# Altium schematic sheet PIC Microcontroller.SchDoc: AA Design Challenge
size 431 x 279 mm; Revision: 1.0; SheetNumber: 3; SheetTotal: 4; ProjectName: TRK_GPRS_GNSS_BTLE
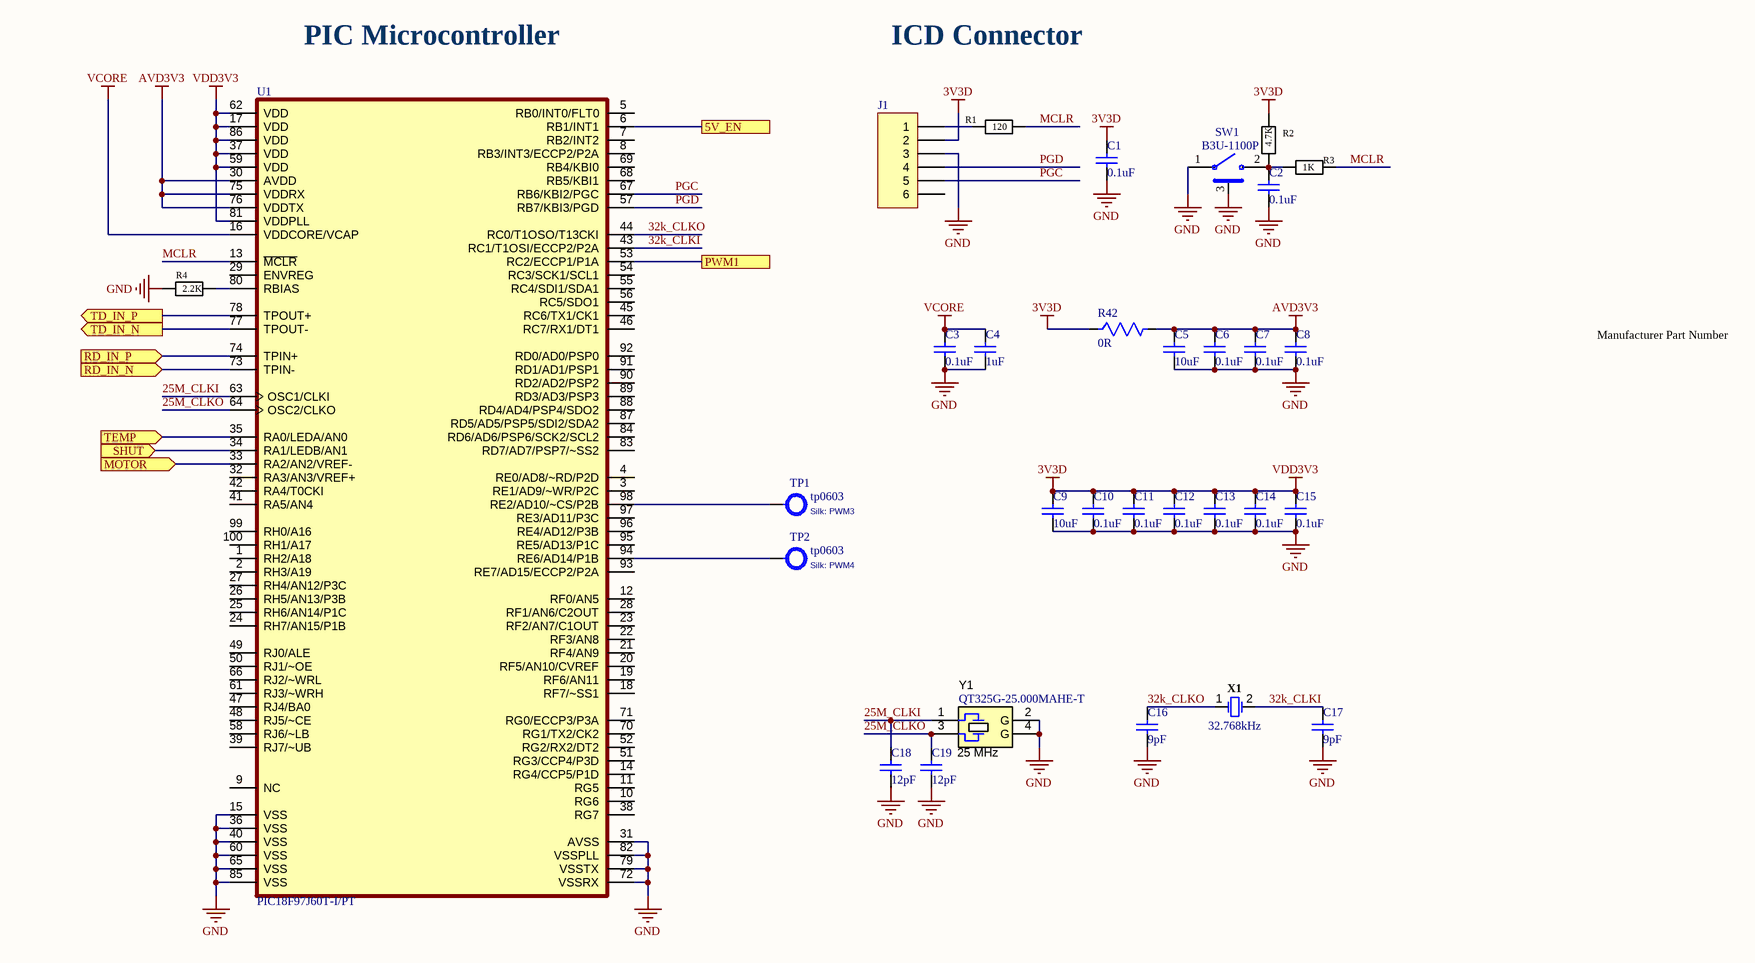
[diagram p0: PIC Microcontroller.SchDoc]

## Parts
C1  0.1uF  [CAPC1005X61USR]
C2  0.1uF  [CAPC1005X61USR]
C3  0.1uF  [CAPC1005X61USR]
C4  1uF  [CAPC1005X61USR]
C5  10uF  [CAPC1005X61USR]
C6  0.1uF  [CAPC1005X61USR]
C7  0.1uF  [CAPC1005X61USR]
C8  0.1uF  [CAPC1005X61USR]
C9  10uF  [CAPC1005X61USR]
C10  0.1uF  [CAPC1005X61USR]
C11  0.1uF  [CAPC1005X61USR]
C12  0.1uF  [CAPC1005X61USR]
C13  0.1uF  [CAPC1005X61USR]
C14  0.1uF  [CAPC1005X61USR]
C15  0.1uF  [CAPC1005X61USR]
C16  9pF  [CAPC1005X61USR]
C17  9pF  [CAPC1005X61USR]
C18  12pF  [CAPC1005X61USR]
C19  12pF  [CAPC1005X61USR]
J1  Header 6  [HDR1X6]  (value not drawn)  (no BOM)
R1  120  [RESC1005X40USR]
R2  4.7K  [RESC1005X40USR]
R3  1K  [RESC1005X40USR]
R4  2.2K  [RESC1005X40USR]
R42  0R  [R_0603]
SW1  B3U-1100P  [SW_B3U-1100P]
TP1  tp0603  Silk: PWM3  [TP 1mm]
TP2  tp0603  Silk: PWM4  [TP 1mm]
U1  PIC18F97J60T-I/PT  [QFP40P1400X1400X120-100N]
X1  32.768kHz  [XTAL_3215]
Y1  QT325G-25.000MAHE-T  Frequency_Fixed: 25 MHz  [XTAL_3225]

## Ports
5V_EN, MOTOR (in), PWM1, RD_IN_N (in), RD_IN_P (in), SHUT (in), TD_IN_N (out), TD_IN_P (out), TEMP (in)

## Nets
3V3D: C1.1 C9.1 C10.1 C11.1 C12.1 C13.1 C14.1 C15.1 J1.2 R2.1 R42.1 U1.17(VDD) U1.37(VDD) U1.59(VDD) U1.62(VDD) U1.81(VDDPLL) U1.86(VDD)  [also labelled VDD3V3]
AVD3V3: C5.1 C6.1 C7.1 C8.1 R42.2 U1.30(AVDD) U1.75(VDDRX) U1.76(VDDTX)
GND: C1.2 C2.2 C3.2 C4.1 C5.2 C6.2 C7.2 C8.2 C9.2 C10.2 C11.2 C12.2 C13.2 C14.2 C15.2 C16.2 C17.2 C18.2 C19.2 J1.3 R4.1 SW1.1 SW1.3 U1.15(VSS) U1.31(AVSS) U1.36(VSS) U1.40(VSS) U1.60(VSS) U1.65(VSS) U1.72(VSSRX) U1.79(VSSTX) U1.82(VSSPLL) U1.85(VSS) Y1.2(GND) Y1.4(GND)
VCORE: C3.1 C4.2 U1.16(VDDCORE/VCAP)
5V_EN: U1.6(RB1/INT1) ; port 5V_EN
25M_CLKI: C18.1 U1.63(OSC1/CLKI) Y1.1
25M_CLKO: C19.1 U1.64(OSC2/CLKO) Y1.3
32k_CLKI: C17.1 U1.43(RC1/T1OSI/ECCP2/P2A) X1.2
32k_CLKO: C16.1 U1.44(RC0/T1OSO/T13CKI) X1.1
MCLR: R1.2 R3.2 U1.13(~{MCLR})
MOTOR: U1.33(RA2/AN2/VREF-) ; port MOTOR
PGC: J1.5 U1.67(RB6/KBI2/PGC)
PGD: J1.4 U1.57(RB7/KBI3/PGD)
PWM1: U1.53(RC2/ECCP1/P1A) ; port PWM1
RD_IN_N: U1.73(TPIN-) ; port RD_IN_N
RD_IN_P: U1.74(TPIN+) ; port RD_IN_P
SHUT: U1.34(RA1/LEDB/AN1) ; port SHUT
TD_IN_N: U1.77(TPOUT-) ; port TD_IN_N
TD_IN_P: U1.78(TPOUT+) ; port TD_IN_P
TEMP: U1.35(RA0/LEDA/AN0) ; port TEMP
NetC2_1: C2.1 R2.2 R3.1 SW1.2
NetJ1_1: J1.1 R1.1
NetR4_2: R4.2 U1.80(RBIAS)
NetTP1_1: TP1.1 U1.98(RE2/AD10/~CS/P2B)
NetTP2_1: TP2.1 U1.94(RE6/AD14/P1B)

Not connected (* = marked no-connect by the designer): J1 6; U1 1(RH2/A18) 2(RH3/A19) 3(RE1/AD9/~WR/P2C) 4(RE0/AD8/~RD/P2D) 5(RB0/INT0/FLT0) 7(RB2/INT2) 8(RB3/INT3/ECCP2/P2A) 9(NC) 10(RG6) 11(RG5) 12(RF0/AN5) 14(RG4/CCP5/P1D) 18(RF7/~SS1) 19(RF6/AN11) 20(RF5/AN10/CVREF) 21(RF4/AN9) 22(RF3/AN8) 23(RF2/AN7/C1OUT) 24(RH7/AN15/P1B) 25(RH6/AN14/P1C) 26(RH5/AN13/P3B) 27(RH4/AN12/P3C) 28(RF1/AN6/C2OUT) 29(ENVREG) 32(RA3/AN3/VREF+) 38(RG7) 39(RJ7/~UB) 41(RA5/AN4) 42(RA4/T0CKI) 45(RC6/TX1/CK1) 46(RC7/RX1/DT1) 47(RJ4/BA0) 48(RJ5/~CE) 49(RJ0/ALE) 50(RJ1/~OE) 51(RG3/CCP4/P3D) 52(RG2/RX2/DT2) 54(RC3/SCK1/SCL1) 55(RC4/SDI1/SDA1) 56(RC5/SDO1) 58(RJ6/~LB) 61(RJ3/~WRH) 66(RJ2/~WRL) 68(RB5/KBI1) 69(RB4/KBI0) 70(RG1/TX2/CK2) 71(RG0/ECCP3/P3A) 83(RD7/AD7/PSP7/~SS2) 84(RD6/AD6/PSP6/SCK2/SCL2) 87(RD5/AD5/PSP5/SDI2/SDA2) 88(RD4/AD4/PSP4/SDO2) 89(RD3/AD3/PSP3) 90(RD2/AD2/PSP2) 91(RD1/AD1/PSP1) 92(RD0/AD0/PSP0) 93(RE7/AD15/ECCP2/P2A) 95(RE5/AD13/P1C) 96(RE4/AD12/P3B) 97(RE3/AD11/P3C) 99(RH0/A16) 100(RH1/A17)

## Notes on the sheet
- PIC Microcontroller
- ICD Connector
- Manufacturer Part Number
- DWG. NO.
- REV.
- SHT.
- THIS DOCUMENT AND THE DATA DISCLOSED HEREIN OR HEREWITH IS THE PROPERTY OF ALTIUM LIMITED AND MAY BE FREELY DISTRIBUTED IN WHOLE. NO RIGHTS ARE RESERVED OR EXPRESS OR IMPLIED WARANTEE GIVEN.
- REVISION
- DESCRIPTION
- DATE
- APPROVED
- ENG:
- APPROVALS
- PROJECT
- DSN:
- CHK:
- REFERENCE DOCUMENTS
- PROJECT REVISION:
- TITLE
- DOCUMENT REVISION:
- DESIGN ITEM:
- BOM:
- FAB DWG:
- PCB DWG:
- ASSY DWG:
- SCALE:
- SIZE
- B
- CAGE CODE
- FILE NAME
- DWG NO.
- SHEET
- OF
- REV
- (in symbol ABM8AIG-25.000MHZ-12-2Z-T3) G

## Library data of the parts
C1-C3 C6-C8 C10-C15 = Cap: CAP CER 0.1UF 50V X7R 0402; Manufacturer: TDK Corporation; Manufacturer Part Number: CGA2B3X7R1H104K050BB; Supplier Part Number 1: 445-6899-2-ND; Supplier Part Number 2: *; Supplier 1: *; Supplier 2: *; 100pc cost: *; 1pc cost: *; Height: *; value: 0.1uF
C4 = Cap: CAP CER 1UF 16V X5R 0402; Manufacturer: Samsung Electro-Mechanics; Manufacturer Part Number: CL05A105KO5NNNC; Supplier Part Number 1: 1276-1067-2-ND; Supplier Part Number 2: *; Supplier 1: *; Supplier 2: *; 100pc cost: *; 1pc cost: *; Height: *; value: 1uF
C5 C9 = Cap: CAP CER 10UF 10V X5R 0402; Manufacturer: Samsung Electro-Mechanics; Manufacturer Part Number: CL05A106MP8NUB8; Supplier Part Number 1: 1276-6830-2-ND; Supplier Part Number 2: *; Supplier 1: *; Supplier 2: *; 100pc cost: *; 1pc cost: *; Height: *; value: 10uF
C16 C17 = Cap: CAP CER 9PF 50V C0G/NPO 0402; Manufacturer: Yageo; Manufacturer Part Number: CC0402BRNPO9BN9R0; Supplier Part Number 1: 311-1629-2-ND; Supplier Part Number 2: *; Supplier 1: *; Supplier 2: *; 100pc cost: *; 1pc cost: *; Height: *; value: 9pF
C18 C19 = Cap: CAP CER 12PF 50V C0G 0402; Manufacturer: TDK Corporation; Manufacturer Part Number: CGA2B2C0G1H120J050BA; Supplier Part Number 1: 445-5585-2-ND; Supplier Part Number 2: *; Supplier 1: *; Supplier 2: *; 100pc cost: *; 1pc cost: *; Height: *; value: 12pF
J1 = Header 6: Header, 6-Pin; LatestRevisionDate: 17-Jul-2002; LatestRevisionNote: Re-released for DXP Platform.; Publisher: Altium Limited
R1 = R: RES SMD 120 OHM 1% 1/16W 0402; Manufacturer: Yageo; Manufacturer Part Number: RC0402FR-07120RL; Power Rating: 62.5mW; Tolerance: +/-1%; Voltage Rating: NA; Distributor: DigiKey; Value: 120; Distributor Art. Nbr.: 311-120LRTR-ND; Package: EIA-0402; Price Estim. @ 100pcs: 0.0049; Height: 0.40mm
R2 = R: RES SMD 4.7K OHM 1% 1/16W 0402; Manufacturer: Yageo; Manufacturer Part Number: RC0402FR-074K7L; Power Rating: 62.5mW; Tolerance: +/-1%; Voltage Rating: NA; Distributor: DigiKey; Value: 4.7K; Distributor Art. Nbr.: 311-4.7KLRTR-ND; Package: EIA-0402; Price Estim. @ 100pcs: 0.0049; Height: 0.40mm
R3 = R: RES SMD 1K OHM 1% 1/16W 0402; Manufacturer: Yageo; Manufacturer Part Number: RC0402FR-071KL; Power Rating: 62.5mW; Tolerance: +/-1%; Voltage Rating: NA; Distributor: DigiKey; Value: 1K; Distributor Art. Nbr.: 311-1.00KLRTR-ND; Package: EIA-0402; Price Estim. @ 100pcs: 0.0049; Height: 0.40mm
R4 = R: RES SMD 2.2K OHM 1% 1/16W 0402; Manufacturer: Yageo; Manufacturer Part Number: RC0402FR-072K2L; Power Rating: 62.5mW; Tolerance: +/-1%; Voltage Rating: NA; Distributor: DigiKey; Value: 2.2K; Distributor Art. Nbr.: 311-2.20KLRTR-ND; Package: EIA-0402; Price Estim. @ 100pcs: 0.0049; Height: 0.40mm
R42 = Res 0R 1/10W 0603: Fixed Resistor, Metal Glaze/thick Film, 0.1W, 0ohm, Surface Mount, 0603; Manufacturer: Yageo; Manufacturer Part Number: RC0603FR-070RL; Rated Power Dissipation (P): 100mW; Rated Temperature: 70°C; Supplier 1: Mouser; Supplier Part Number 1: 603-RC0603FR-070RL; RoHS: Yes; Category: Chip SMD Resistors; Stock 1: 4979913; Pricing 1: 1=0.10000, 10=0.01200, 50=0.01200, 100=0.00900, 1000=0.00500, 10000=0.00300 (USD); Mount: Surface Mount; Number of Pins: 2; Package Shape: Rectangular; Size Code: 0603; Terminal Finish: Nickel; Min Operating Temperature: -55°C; Max Operating Temperature: 155°C; JESD-609 Code: e3; Resistor Type: FIXED RESISTOR; Packaging: Tape and Reel; Resistance: 0R; Termination: Wraparound; Technology: METAL GLAZE/THICK FILM; REACH SVHC: Yes; RoHS Compliant: Yes; ComponentLink1URL: https://datasheet.ciiva.com:443/pdfs/VipMasterIC/IC/YAGO/YAGOS02869/YAGOS02869-1.pdf?src-supplier=IHS+Markit; ComponentLink1Description: https://datasheet.ciiva.com:443/pdfs/VipMasterIC/IC/YAGO/YAGOS02869/YAGOS02869-1.pdf?src-supplier=IHS+Markit; ComponentLink2URL: https://datasheet.ciiva.com/11808/0900766b80f96399-11808172.pdf?src-supplier=RSComponents; ComponentLink2Description: https://datasheet.ciiva.com/11808/0900766b80f96399-11808172.pdf?src-supplier=RSComponents; ComponentLink3URL: https://datasheet.ciiva.com/5684/443971-5684699.pdf?src-supplier=Farnell; ComponentLink3Description: https://datasheet.ciiva.com/5684/443971-5684699.pdf?src-supplier=Farnell; ComponentLink4URL: https://datasheet.ciiva.com/7983/443971-7983627.pdf?src-supplier=Element14; ComponentLink4Description: https://datasheet.ciiva.com/7983/443971-7983627.pdf?src-supplier=Element14; ComponentLink5URL: https://datasheet.ciiva.com/22643/1868787-22643388.pdf?src-supplier=Element14; ComponentLink5Description: https://datasheet.ciiva.com/22643/1868787-22643388.pdf?src-supplier=Element14; ComponentLink6URL: https://datasheet.ciiva.com/46382/443971-46382072.pdf?src-supplier=Element14; ComponentLink6Description: https://datasheet.ciiva.com/46382/443971-46382072.pdf?src-supplier=Element14; ComponentLink7URL: https://datasheet.ciiva.com/29721/pyu-r-int-thick-7-29721178.pdf?src-supplier=Digi-Key; ComponentLink7Description: https://datasheet.ciiva.com/29721/pyu-r-int-thick-7-29721178.pdf?src-supplier=Digi-Key; ComponentLink8URL: https://datasheet.ciiva.com/29721/pyu-rc0603-51-rohs-l-4-29721179.pdf?src-supplier=Digi-Key; ComponentLink8Description: https://datasheet.ciiva.com/29721/pyu-rc0603-51-rohs-l-4-29721179.pdf?src-supplier=Digi-Key; ComponentLink9URL: https://datasheet.ciiva.com/5558/rc0603-272842-5558341.pdf?src-supplier=Mouser; ComponentLink9Description: https://datasheet.ciiva.com/5558/rc0603-272842-5558341.pdf?src-supplier=Mouser
SW1 = B3U-1100P: SWITCH TACTILE SPST-NO 0.05A 12V; Manufacturer: Omron; Package: None; Supplier Part Number 1: SW1021TR-ND; Manufacturer Part Number: B3U-1100P; Price: None
TP1 TP2 = Testpkt0603: Part Number: 4001364; Mount option: Not Mounted; ALT_SYMBOL: tp0603_wave; Device_class: DISCRETE; Part Type: TP; PCB Footprint: tp0603
U1 = PIC18F97J60T-I/PT: IC MCU 8BIT 128KB FLASH 100TQFP (12x12); Manufacturer: Microchip; Availability: Unavailable; Price: None; Digi-Key Part Number: PIC18F97J60T-I/PTTR-ND; Value: *; Manufacturer Product Number: PIC18F97J60T-I/PT; Package: TQFP-100 Microchip; BuyPart: PIC18F97J60T-I/PT
X1 = XTAL-1-2-2: CRYSTAL 32.7680KHZ 9PF SMD; Manufacturer: EPSON; Manufacturer Part Number: FC-135 32.7680KA-AC0; Supplier Part Number 1: SER4084TR-ND; Package: 2-SMD(3215); Supplier 1: Digi-Key; Height: 0.90mm; value: 32.768kHz
Y1 = ABM8AIG-25.000MHZ-12-2Z-T3: CRYSTAL 25.0000MHZ 12PF SMD; Manufacturer: QST; Frequency Stability: ±30ppm; Manufacturer Part Number: QT325G-25.000MAHE-T; CompType: Crystal; PackageReference: 3.2x2.5mm; MountType: SMT; ComponentLink1Description: Datasheet Link; ComponentLink1URL: http://www.abracon.com/AIGcrystals/ABM8AIG.pdf; Supplier Part Number 1: 2388-SXT32412AA16-25.000MTR-ND